# EAGLE design LTC_Balancer2_test (EAGLE 5.06)
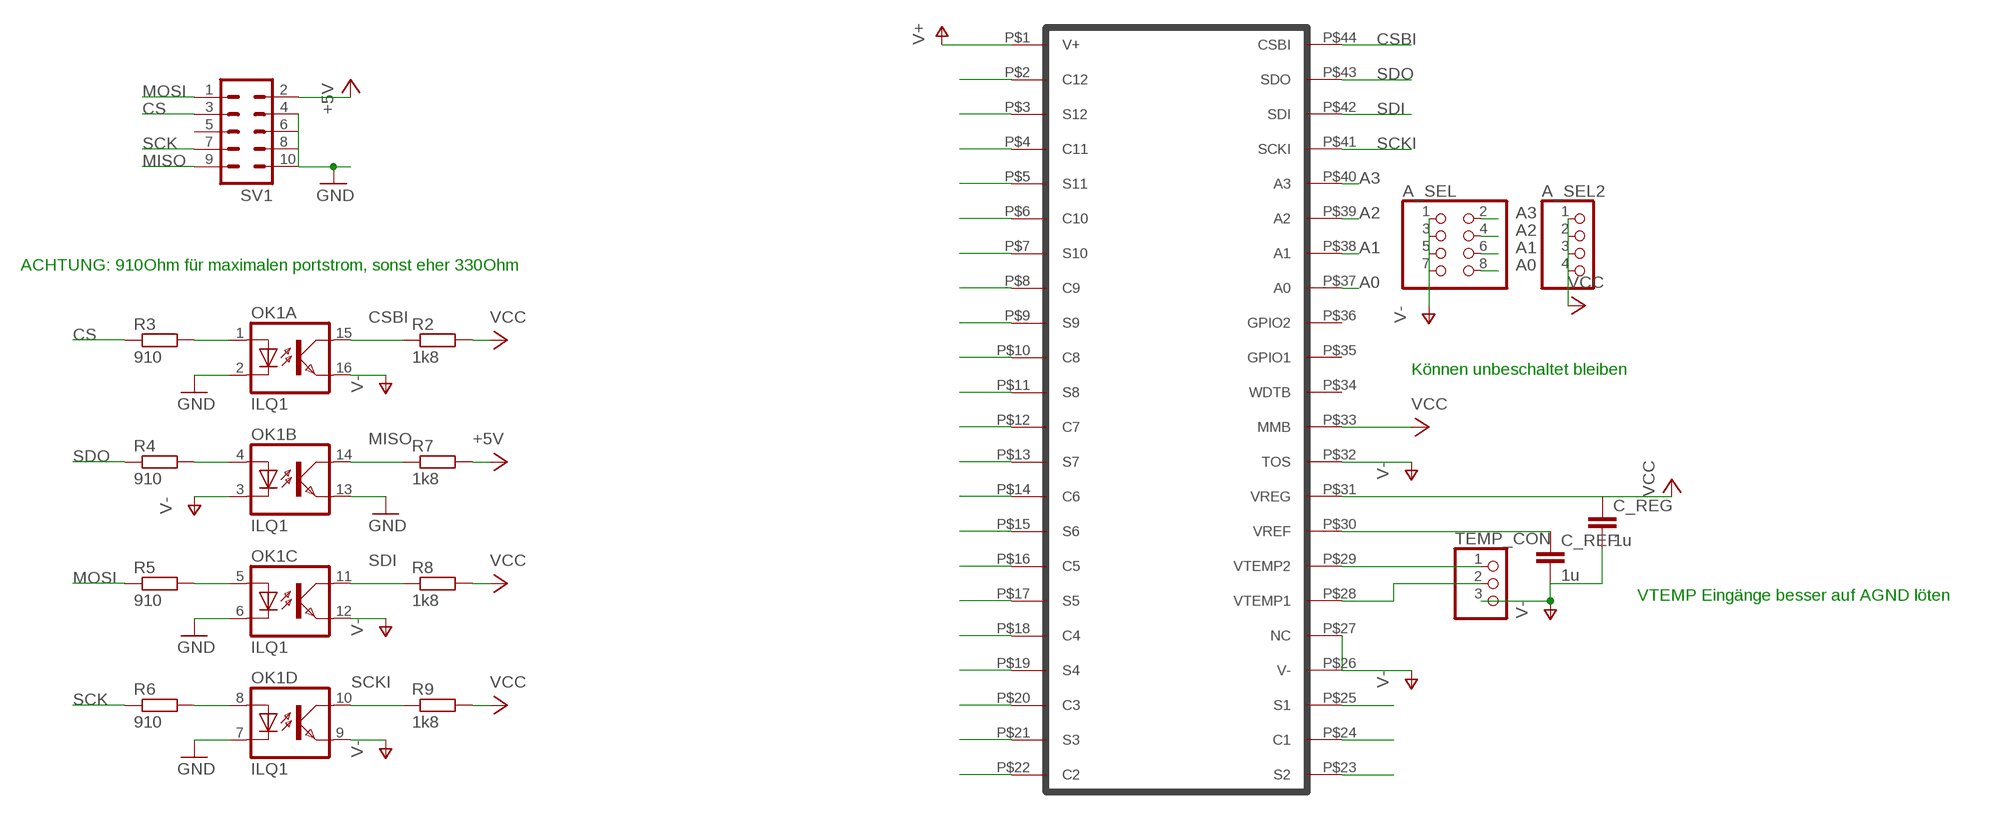
[diagram p0: schematic, sheet 1, part 1 of 2]
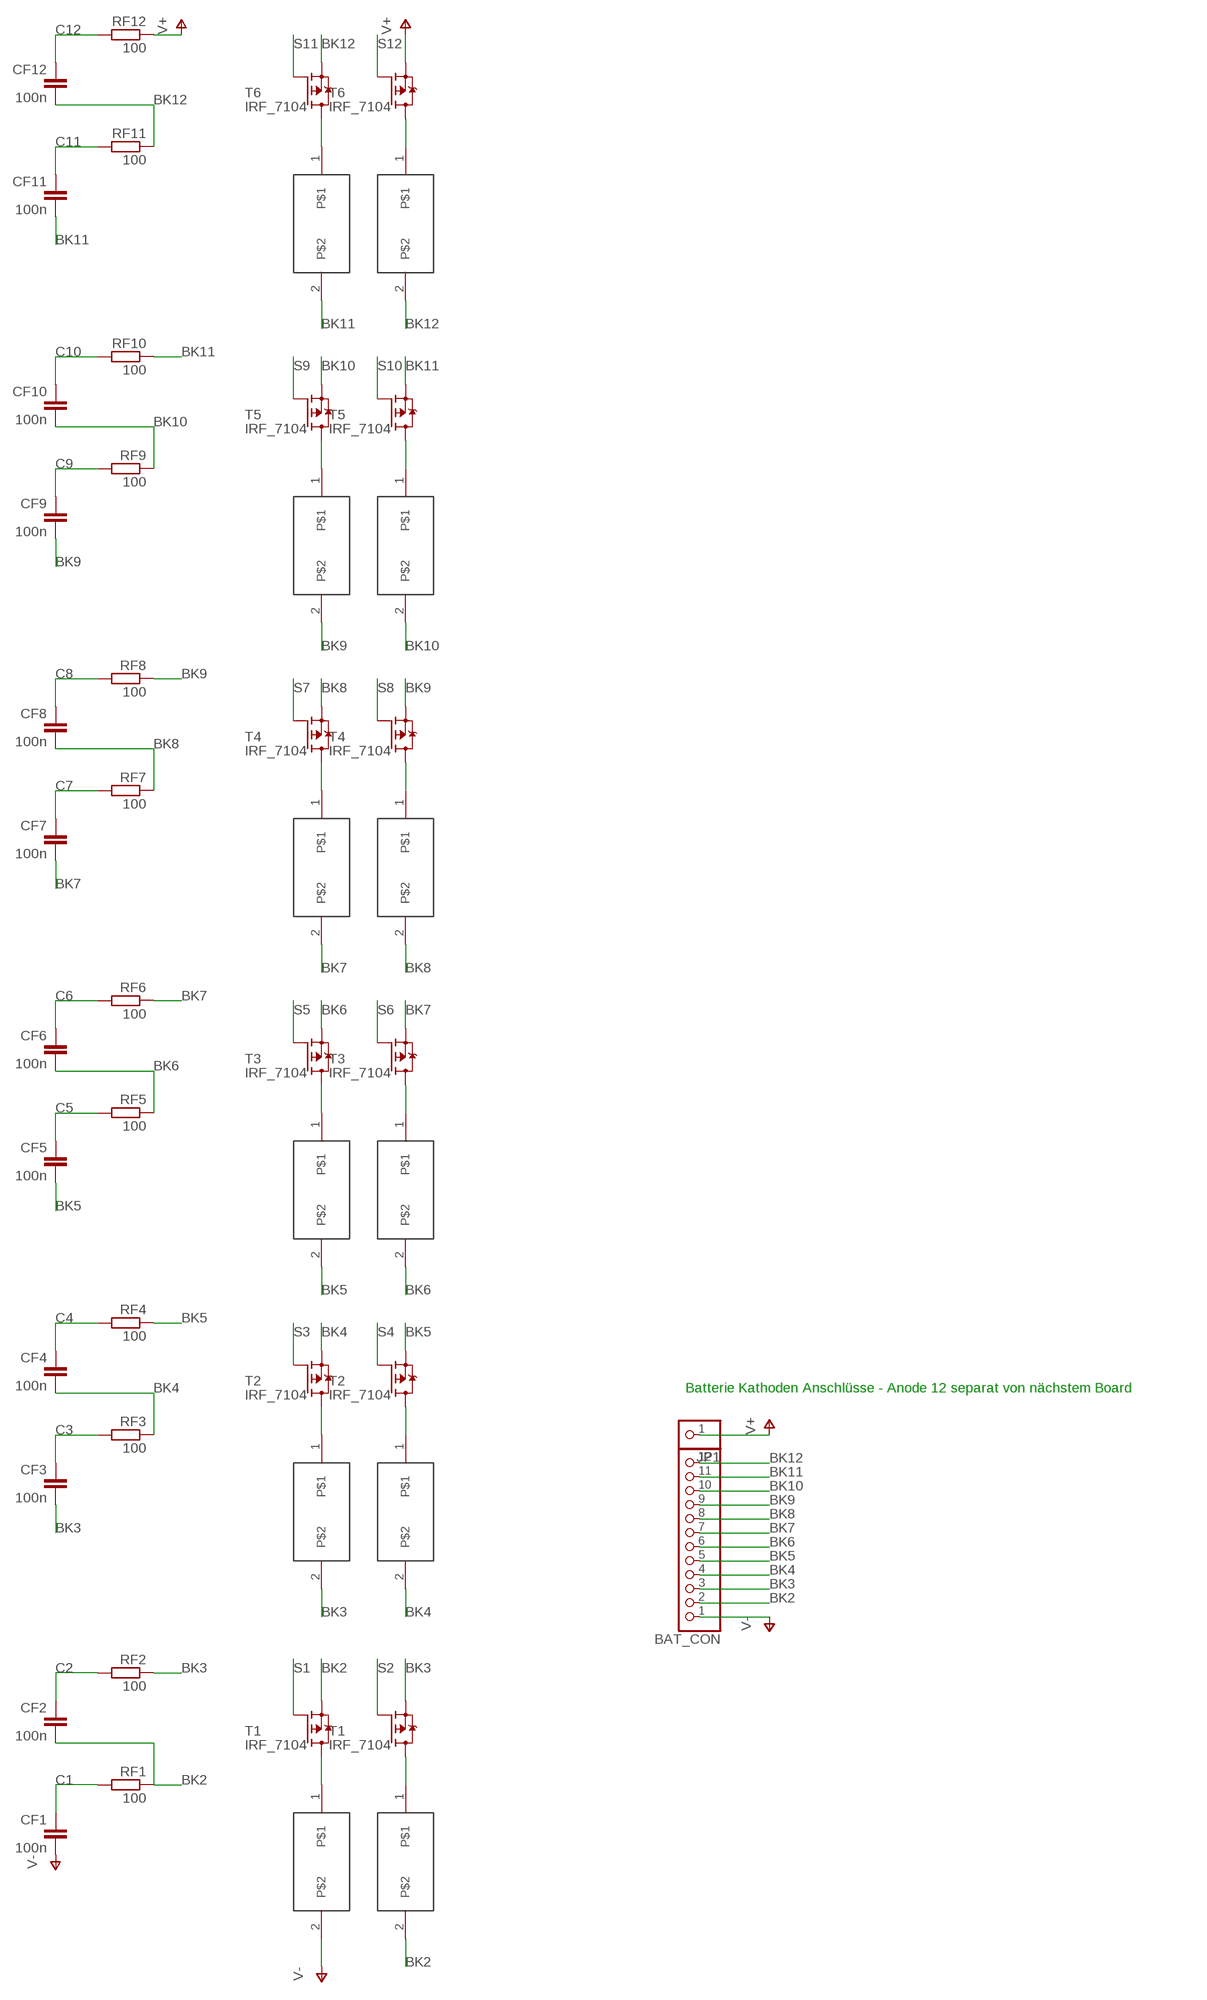
[diagram p1: schematic, sheet 1, part 2 of 2]

## Parts
A_SEL  PINHD-2X4  [2X04]
A_SEL2  PINHD-1X4  [1X04]
BAT_CON  PINHD-1X12  [1X12]
C_REF  1u  C-EUC1206  [C1206]
C_REG  1u  C-EUC1206  [C1206]
CF1  100n  C-EUC1206  [C1206]
CF2  100n  C-EUC1206  [C1206]
CF3  100n  C-EUC1206  [C1206]
CF4  100n  C-EUC1206  [C1206]
CF5  100n  C-EUC0805  [C0805]
CF6  100n  C-EUC0805  [C0805]
CF7  100n  C-EUC1206  [C1206]
CF8  100n  C-EUC1206  [C1206]
CF9  100n  C-EUC1206  [C1206]
CF10  100n  C-EUC1206  [C1206]
CF11  100n  C-EUC1206  [C1206]
CF12  100n  C-EUC1206  [C1206]
JP1  PINHD-1X1  [1X01]
OK1  ILQ1  [DIL16]
R2  1k8  R-EU_R1206  [R1206]
R3  910  R-EU_R1206  [R1206]
R4  910  R-EU_R1206  [R1206]
R5  910  R-EU_R1206  [R1206]
R6  910  R-EU_R1206  [R1206]
R7  1k8  R-EU_R1206  [R1206]
R8  1k8  R-EU_R1206  [R1206]
R9  1k8  R-EU_R1206  [R1206]
RF1  100  R-EU_R1206  [R1206]
RF2  100  R-EU_R1206  [R1206]
RF3  100  R-EU_R1206  [R1206]
RF4  100  R-EU_R1206  [R1206]
RF5  100  R-EU_R1206  [R1206]
RF6  100  R-EU_R1206  [R1206]
RF7  100  R-EU_R1206  [R1206]
RF8  100  R-EU_R1206  [R1206]
RF9  100  R-EU_R1206  [R1206]
RF10  100  R-EU_R1206  [R1206]
RF11  100  R-EU_R1206  [R1206]
RF12  100  R-EU_R1206  [R1206]
RL1  R_5W  [R_5W]
RL2  R_5W  [R_5W]
RL3  R_5W  [R_5W]
RL4  R_5W  [R_5W]
RL5  R_5W  [R_5W]
RL6  R_5W  [R_5W]
RL7  R_5W  [R_5W]
RL8  R_5W  [R_5W]
RL9  R_5W  [R_5W]
RL10  R_5W  [R_5W]
RL11  R_5W  [R_5W]
RL12  R_5W  [R_5W]
SV1  ML10  [ML10]
T1  IRF_7104  [SO8]
T2  IRF_7104  [SO8]
T3  IRF_7104  [SO8]
T4  IRF_7104  [SO8]
T5  IRF_7104  [SO8]
T6  IRF_7104  [SO8]
TEMP_CON  PINHD-1X3  [1X03]
U$1  LTC6802-2  [SSOP48]

## Nets
+5V: R7.2 SV1.2
A0: A_SEL.8 U$1.P$37(A0)
A1: A_SEL.6 U$1.P$38(A1)
A2: A_SEL.4 U$1.P$39(A2)
A3: A_SEL.2 U$1.P$40(A3)
ASD: RL5.1 T3.7(D2)
BK2: BAT_CON.2 CF2.2 RF1.1 RL2.2 T1.1(S2)
BK3: BAT_CON.3 CF3.2 RF2.1 RL3.2 T1.3(S1)
BK4: BAT_CON.4 CF4.2 RF3.1 RL4.2 T2.1(S2)
BK5: BAT_CON.5 CF5.2 RF4.1 RL5.2 T2.3(S1)
BK6: BAT_CON.6 CF6.2 RF5.1 RL6.2 T3.1(S2)
BK7: BAT_CON.7 CF7.2 RF6.1 RL7.2 T3.3(S1)
BK8: BAT_CON.8 CF8.2 RF7.1 RL8.2 T4.1(S2)
BK9: BAT_CON.9 CF9.2 RF8.1 RL9.2 T4.3(S1)
BK10: BAT_CON.10 CF10.2 RF9.1 RL10.2 T5.1(S2)
BK11: BAT_CON.11 CF11.2 RF10.1 RL11.2 T5.3(S1)
BK12: BAT_CON.12 CF12.2 RF11.1 RL12.2 T6.1(S2)
C1: CF1.1 RF1.2 U$1.P$24(C1)
C2: CF2.1 RF2.2 U$1.P$22(C2)
C3: CF3.1 RF3.2 U$1.P$20(C3)
C4: CF4.1 RF4.2 U$1.P$18(C4)
C5: CF5.1 RF5.2 U$1.P$16(C5)
C6: CF6.1 RF6.2 U$1.P$14(C6)
C7: CF7.1 RF7.2 U$1.P$12(C7)
C8: CF8.1 RF8.2 U$1.P$10(C8)
C9: CF9.1 RF9.2 U$1.P$8(C9)
C10: CF10.1 RF10.2 U$1.P$6(C10)
C11: CF11.1 RF11.2 U$1.P$4(C11)
C12: CF12.1 RF12.2 U$1.P$2(C12)
CS: R3.1 SV1.3
CSBI: OK1.15(A:COL) R2.1 U$1.P$44(CSBI)
GND: OK1.2(A:C) OK1.6(C:C) OK1.7(D:C) OK1.13(B:EMIT) SV1.4 SV1.6 SV1.8 SV1.10
MISO: OK1.14(B:COL) R7.1 SV1.9
MOSI: R5.1 SV1.1
N$1: OK1.1(A:A) R3.2
N$2: TEMP_CON.1 U$1.P$29(VTEMP2)
N$3: C_REF.1 U$1.P$30(VREF)
N$4: TEMP_CON.2 U$1.P$28(VTEMP1)
N$5: RL3.1 T2.7(D2)
N$6: RL4.1 T2.5(D1)
N$8: RL1.1 T1.7(D2)
N$9: RL2.1 T1.5(D1)
N$10: RL6.1 T3.5(D1)
N$11: RL7.1 T4.7(D2)
N$12: RL8.1 T4.5(D1)
N$13: RL9.1 T5.7(D2)
N$14: RL10.1 T5.5(D1)
N$15: RL11.1 T6.7(D2)
N$16: RL12.1 T6.5(D1)
N$19: OK1.4(B:A) R4.2
N$20: OK1.5(C:A) R5.2
N$21: OK1.8(D:A) R6.2
S1: T1.2(G2) U$1.P$25(S1)
S2: T1.4(G1) U$1.P$23(S2)
S3: T2.2(G2) U$1.P$21(S3)
S4: T2.4(G1) U$1.P$19(S4)
S5: T3.2(G2) U$1.P$17(S5)
S6: T3.4(G1) U$1.P$15(S6)
S7: T4.2(G2) U$1.P$13(S7)
S8: T4.4(G1) U$1.P$11(S8)
S9: T5.2(G2) U$1.P$9(S9)
S10: T5.4(G1) U$1.P$7(S10)
S11: T6.2(G2) U$1.P$5(S11)
S12: T6.4(G1) U$1.P$3(S12)
SCK: R6.1 SV1.7
SCKI: OK1.10(D:COL) R9.1 U$1.P$41(SCKI)
SDI: OK1.11(C:COL) R8.1 U$1.P$42(SDI)
SDO: R4.1 U$1.P$43(SDO)
V+: JP1.1 RF12.1 T6.3(S1)
V-: A_SEL.1 A_SEL.3 A_SEL.5 A_SEL.7 BAT_CON.1 C_REF.2 C_REG.2 CF1.2 OK1.3(B:C) OK1.9(D:EMIT) OK1.12(C:EMIT) OK1.16(A:EMIT) RL1.2 TEMP_CON.3 U$1.P$26(V-) U$1.P$27(NC) U$1.P$32(TOS)
VCC: A_SEL2.1 A_SEL2.2 A_SEL2.3 A_SEL2.4 C_REG.1 R2.2 R8.2 R9.2 U$1.P$31(VREG) U$1.P$33(MMB)
Unconnected: SV1.5 U$1.P$1(V+) U$1.P$34(WDTB) U$1.P$35(GPIO1) U$1.P$36(GPIO2)

## Notes on the sheet
- Batterie Kathoden Anschlüsse - Anode 12 separat von nächstem Board
- ACHTUNG: 910Ohm für maximalen portstrom, sonst eher 330Ohm
- Können unbeschaltet bleiben
- VTEMP Eingänge besser auf AGND löten

## Library data of the parts
A_SEL = pinhead:PINHD-2X4: PIN HEADER
A_SEL2 = pinhead:PINHD-1X4: PIN HEADER
BAT_CON = pinhead:PINHD-1X12: PIN HEADER
C_REF C_REG CF1-CF12 = rcl:C-EU: CAPACITOR, European symbol
JP1 = pinhead:PINHD-1X1: PIN HEADER
OK1 = optocoupler:ILQ1: SIEMENS OPTO COUPLER
R2-R9 RF1-RF12 = rcl:R-EU_: RESISTOR, European symbol
RL1-RL12 = R_Power:R_5W
SV1 = con-ml:ML10: HARTING
T1-T6 = IRF_7104:IRF_7104
TEMP_CON = pinhead:PINHD-1X3: PIN HEADER
U$1 = LTC6802:LTC6802-2

## Board
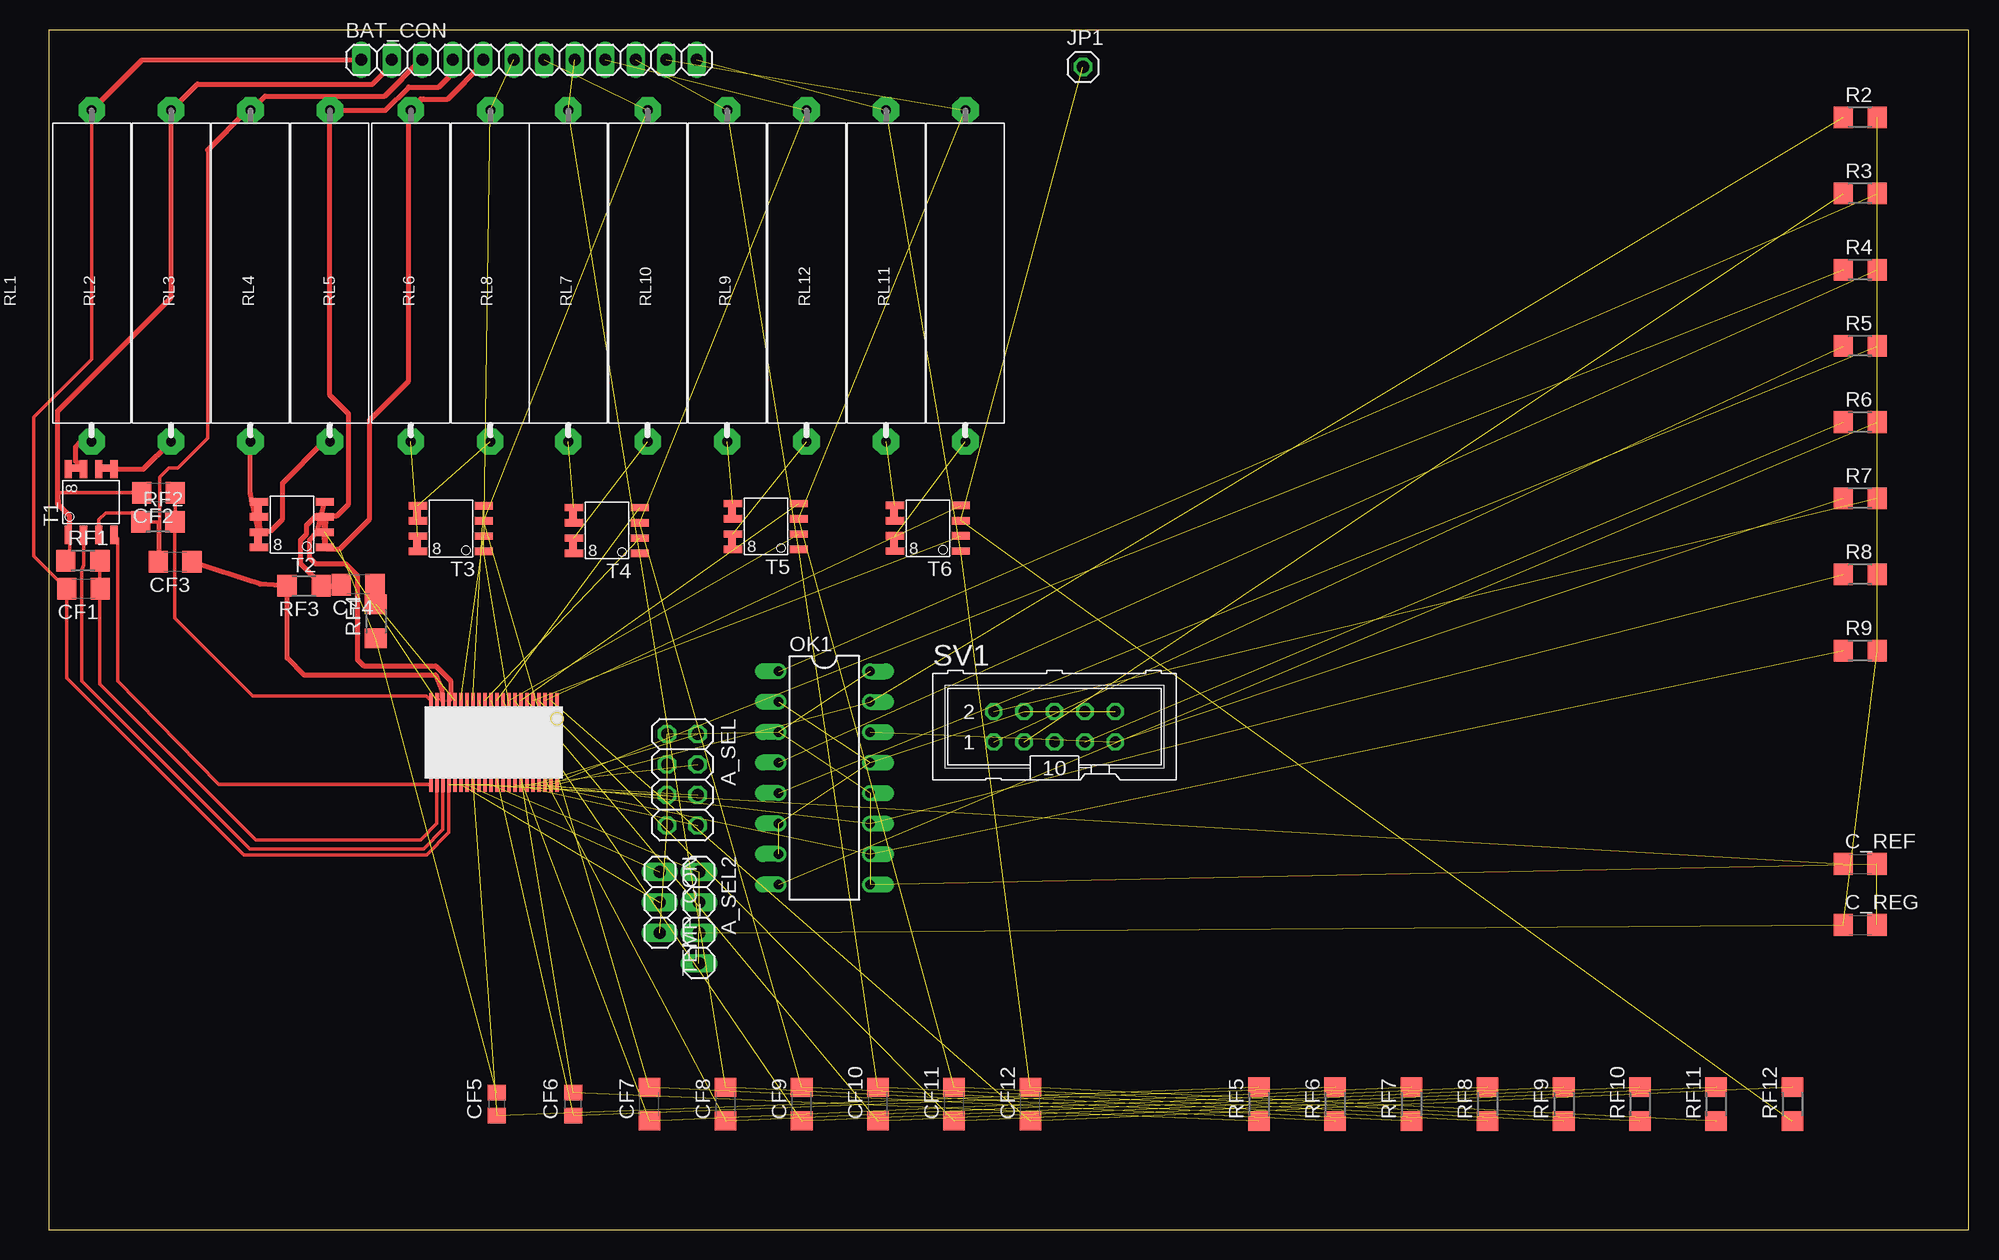
[diagram p2: board, top side]

Size 160 x 100 mm. Coordinates in mm from the lower left corner, seen from the top.
Outline: 0,0 160,0 160,100 0,100 0,0
Copper layers (1*16): Top 0.035mm / dielectric 1.5mm / Bottom 0.035mm
Design rules "default": minimum track width 10mil, minimum drill 24mil, track to track 8mil, track to pad 8mil, pad to pad 8mil, via to via 8mil, smd to smd 8mil, copper to edge 40mil, drill to drill 8mil, minimum pad ring 10mil, minimum via ring 8mil, stop-mask expansion 4mil, vias tented up to drill 0mil, thermal gap 10mil

### Footprints (pad centres in the part's own frame; a part is rotated, then mirrored left to right if it is on the bottom)
2X04 = drill 1.016 octagon: 1 -3.81,-1.27; 2 -3.81,1.27; 3 -1.27,-1.27; 4 -1.27,1.27; 5 1.27,-1.27; 6 1.27,1.27; 7 3.81,-1.27; 8 3.81,1.27
1X04 = drill 1.016 long: 1 -3.81,0; 2 -1.27,0; 3 1.27,0; 4 3.81,0
1X12 = drill 1.016 long: 1 -13.97,0; 2 -11.43,0; 3 -8.89,0; 4 -6.35,0; 5 -3.81,0; 6 -1.27,0; 7 1.27,0; 8 3.81,0; 9 6.35,0; 10 8.89,0; 11 11.43,0; 12 13.97,0
C1206 = smd 1.6 x 1.8: 1 -1.4,0; 2 1.4,0
C0805 = smd 1.3 x 1.5: 1 -0.95,0; 2 0.95,0
1X01 = drill 1.016 octagon: 1 0,0
DIL16 = drill 0.813 offset: 1 -8.89,-3.81; 2 -6.35,-3.81; 3 -3.81,-3.81; 4 -1.27,-3.81; 5 1.27,-3.81; 6 3.81,-3.81; 7 6.35,-3.81; 8 8.89,-3.81; 9 8.89,3.81; 10 6.35,3.81; 11 3.81,3.81; 12 1.27,3.81; 13 -1.27,3.81; 14 -3.81,3.81; 15 -6.35,3.81; 16 -8.89,3.81
R1206 = smd 1.6 x 1.803: 1 -1.422,0; 2 1.422,0
R_5W = drill 0.813 pad 2.184 octagon: 1 0.46,0; 2 28.08,0
ML10 = drill 0.914 octagon: 1 -5.08,-1.27; 2 -5.08,1.27; 3 -2.54,-1.27; 4 -2.54,1.27; 5 0,-1.27; 6 0,1.27; 7 2.54,-1.27; 8 2.54,1.27; 9 5.08,-1.27; 10 5.08,1.27
SO8 = smd 1.524 x 0.61: 1 1.067,4.445; 2 1.067,3.175; 3 1.067,1.905; 4 1.067,0.635; 5 6.553,0.635; 6 6.553,1.905; 7 6.553,3.175; 8 6.553,4.445 | smd 0.61 x 1.524: 9 6.635,3.703; 10 6.635,1.203
1X03 = drill 1.016 long: 1 -2.54,0; 2 0,0; 3 2.54,0
SSOP48 = smd 0.3 x 1.25: P$1 0,0.5; P$2 0.5,0.5; P$3 1,0.5; P$4 1.5,0.5; P$5 2,0.5; P$6 2.5,0.5; P$7 3,0.5; P$8 3.5,0.5; P$9 4,0.5; P$10 4.5,0.5; P$11 5,0.5; P$12 5.5,0.5; P$13 6,0.5; P$14 6.5,0.5; P$15 7,0.5; P$16 7.5,0.5; P$17 8,0.5; P$18 8.5,0.5; P$19 9,0.5; P$20 9.5,0.5; P$21 10,0.5; P$22 10.5,0.5; P$23 10.5,7.5; P$24 10,7.5; P$25 9.5,7.5; P$26 9,7.5; P$27 8.5,7.5; P$28 8,7.5; P$29 7.5,7.5; P$30 7,7.5; P$31 6.5,7.5; P$32 6,7.5; P$33 5.5,7.5; P$34 5,7.5; P$35 4.5,7.5; P$36 4,7.5; P$37 3.5,7.5; P$38 3,7.5; P$39 2.5,7.5; P$40 2,7.5; P$41 1.5,7.5; P$42 1,7.5; P$43 0.5,7.5; P$44 0,7.5

### Placement (x,y rotation side)
A_SEL  52.81,37.5 270 top
A_SEL2  54.19,26 270 top
BAT_CON  40.03,97.52 0 top
C_REF  150.96,30.48 0 top
C_REG  150.96,25.4 0 top
CF1  2.9,53.41 180 top
CF2  9.15,61.42 180 top
CF3  10.54,55.66 180 top
CF4  25.79,53.76 180 top
CF5  37.36,10.46 90 top
CF6  43.71,10.46 90 top
CF7  50.06,10.46 90 top
CF8  56.41,10.46 90 top
CF9  62.76,10.46 90 top
CF10  69.11,10.46 90 top
CF11  75.46,10.46 90 top
CF12  81.81,10.46 90 top
JP1  86.19,96.91 0 top
OK1  64.64,37.65 270 top
R2  150.96,92.71 0 top
R3  150.96,86.36 0 top
R4  150.96,80.01 0 top
R5  150.96,73.66 0 top
R6  150.96,67.31 0 top
R7  150.96,60.96 0 top
R8  150.96,54.61 0 top
R9  150.96,48.26 0 top
RF1  2.85,55.76 0 top
RF2  9.1,59 0 top
RF3  21.29,53.66 180 top
RF4  27.26,50.71 90 top
RF5  100.86,10.46 90 top
RF6  107.21,10.46 90 top
RF7  113.56,10.46 90 top
RF8  119.91,10.46 90 top
RF9  126.26,10.46 90 top
RF10  132.61,10.46 90 top
RF11  138.96,10.46 90 top
RF12  145.31,10.46 90 top
RL1  3.58,65.23 90 top
RL2  10.2,65.23 90 top
RL3  16.82,65.23 90 top
RL4  23.44,65.23 90 top
RL5  30.18,65.23 90 top
RL6  36.81,65.23 90 top
RL7  49.92,65.23 90 top
RL8  43.3,65.23 90 top
RL9  63.16,65.23 90 top
RL10  56.54,65.23 90 top
RL11  76.4,65.23 90 top
RL12  69.78,65.23 90 top
SV1  83.82,41.91 0 top
T1  6.08,56.84 90 top
T2  24.08,61.31 180 top
T3  37.33,60.98 180 top
T4  50.33,60.82 180 top
T5  63.58,61.16 180 top
T6  77.08,61 180 top
TEMP_CON  50.93,27.27 270 top
U$1  42.36,44.59 180 top

### Tracks (layer width: path | path; a pad name or v marks a point on that pad's centre or on a via)
+5V  (1 unrouted)
A0  (1 unrouted)
A1  (1 unrouted)
A2  (1 unrouted)
A3  (1 unrouted)
ASD  (1 unrouted)
BK2
  Top 0.305: 1.75,58.02 1.75,56.08 RF1.1 | CF2.2 0.83,61.42 0.88,60.38
  Top 0.406: BAT_CON.2 28.6,97.1 27,95.5 12.39,95.5 RL2.2 10.2,77.7 0.75,68.25 0.75,60.5 0.88,60.38 1.75,59.5 1.75,58.02 T1.1
BK3
  Top 0.305: T1.3 4.17,59.17 4.75,59.75 6.93,59.75 RF2.1 9.25,59 | 13.25,90 13.25,66 10.75,63.5 10,63.5 9.25,62.75 9.25,59 | 9.25,59 9.25,55.77 CF3.2 9.14,58.89 9.25,59
  Top 0.406: BAT_CON.3 31.02,97.52 28,94.5 18.01,94.5 RL3.2 16.56,93.31 13.25,90
BK4
  Top 0.406: 22.92,59.5 T2.1 23.11,59.5 24,59.5 | BAT_CON.4 33.5,97.34 33.5,96.25 32.5,95.25 30,95.25 28.06,93.31 RL4.2 23.44,69.56 25,68 25,60.5 24,59.5 | 24,59.5 22.25,59.5 21.5,58.75 21.5,58 21,57.5 21,55.5 22.25,54.25 22.25,54.12 RF3.1 24.29,53.66 CF4.2
BK5  (2 unrouted)
  Top 0.406: 31.25,94.25 31.12,94.25 RL5.2 | BAT_CON.5 36.22,97.22 33.25,94.25 31.25,94.25 | 31.25,94.25 31,94.25 30,93.25 30,70.75 26.75,67.5 26.75,59.25 24.25,56.75 23.13,56.75 T2.3
BK6  (4 unrouted)
BK7  (4 unrouted)
BK8  (4 unrouted)
BK9  (4 unrouted)
BK10  (4 unrouted)
BK11  (4 unrouted)
BK12  (4 unrouted)
C1
  Top 0.305: RF1.2 4.27,53.44 CF1.1 4.25,53.36 4.25,45.5 17.25,32.5 31,32.5 32.36,33.86 U$1.P$24
C2
  Top 0.305: CF2.1 10.55,59.03 RF2.2 10.52,50.98 17,44.5 31.45,44.5 U$1.P$22
C3
  Top 0.406: CF3.1 17.62,53.81 RF3.2 19.87,47.63 21.25,46.25 32.25,46.25 32.75,45 32.75,44.2 U$1.P$20
C4  (1 unrouted)
  Top 0.406: CF4.1 27.19,52.2 RF4.2
C5  (2 unrouted)
C6  (2 unrouted)
C7  (2 unrouted)
C8  (2 unrouted)
C9  (2 unrouted)
C10  (2 unrouted)
C11  (2 unrouted)
C12  (2 unrouted)
CS  (1 unrouted)
CSBI  (2 unrouted)
GND  (7 unrouted)
MISO  (2 unrouted)
MOSI  (1 unrouted)
N$1  (1 unrouted)
N$2  (1 unrouted)
N$3  (1 unrouted)
N$4  (1 unrouted)
N$5
  Top 0.406: RL3.1 16.82,61.38 T2.7
N$6
  Top 0.406: RL4.1 22.94,65.69 19.5,62.25 19.5,59.25 18.5,58.25 17.64,58.25 T2.5
N$8
  Top 0.406: RL1.1 2.69,65.69 2.25,65.25 2.25,64.05 T1.7
N$9
  Top 0.406: T1.5 7.9,63.39 RL2.1
N$10  (1 unrouted)
N$11  (1 unrouted)
N$12  (1 unrouted)
N$13  (1 unrouted)
N$14  (1 unrouted)
N$15  (1 unrouted)
N$16  (1 unrouted)
N$19  (1 unrouted)
N$20  (1 unrouted)
N$21  (1 unrouted)
N$22
  Top 0.406: 17.5,60.75 17.5,59.5
N$23
  Top 0.406: 17.5,58.25 17.5,56.75
N$24
  Top 0.406: 30.75,60.25 30.75,59.25
N$25
  Top 0.406: 30.75,57.75 30.75,56.5
N$26
  Top 0.406: 43.75,60.25 43.75,59
N$27
  Top 0.406: 43.75,57.5 43.75,56.5
N$28
  Top 0.406: 57,60.5 57,59.25
N$29
  Top 0.406: 57,58 57,56.75
N$30
  Top 0.406: 70.5,60.25 70.5,59.25
N$31
  Top 0.406: 70.5,57.75 70.5,56.5
S1
  Top 0.305: U$1.P$25 32.86,33.36 31.25,31.75 16.75,31.75 2.75,45.75 2.75,55 2.9,55.41 T1.2
S2
  Top 0.305: U$1.P$23 14.16,37.09 5.75,45.75 5.75,57.6 T1.4
S3  (1 unrouted)
S4
  Top 0.406: T2.4 22.39,58.13 21.75,57.5 21.75,56 22.25,55.5 24.75,55.5 25.75,54.5 25.75,47.5 26.25,47 32.25,47 33.5,45.75 33.5,44.23 U$1.P$19
S5  (1 unrouted)
S6  (1 unrouted)
S7  (1 unrouted)
S8  (1 unrouted)
S9  (1 unrouted)
S10  (1 unrouted)
S11  (1 unrouted)
S12  (1 unrouted)
SCK  (1 unrouted)
SCKI  (2 unrouted)
SDI  (2 unrouted)
SDO  (1 unrouted)
V+  (2 unrouted)
V-  (13 unrouted)
  Top 0.305: U$1.P$26 33.36,33.11 31.5,31.25 16.25,31.25 1.5,46 CF1.2 -1.25,56.16 -1.25,67.75 3.58,72.58 RL1.2
  Top 0.406: BAT_CON.1 7.79,97.52 RL1.2
VCC  (9 unrouted)